# Altium project etherceptor.PrjPcb
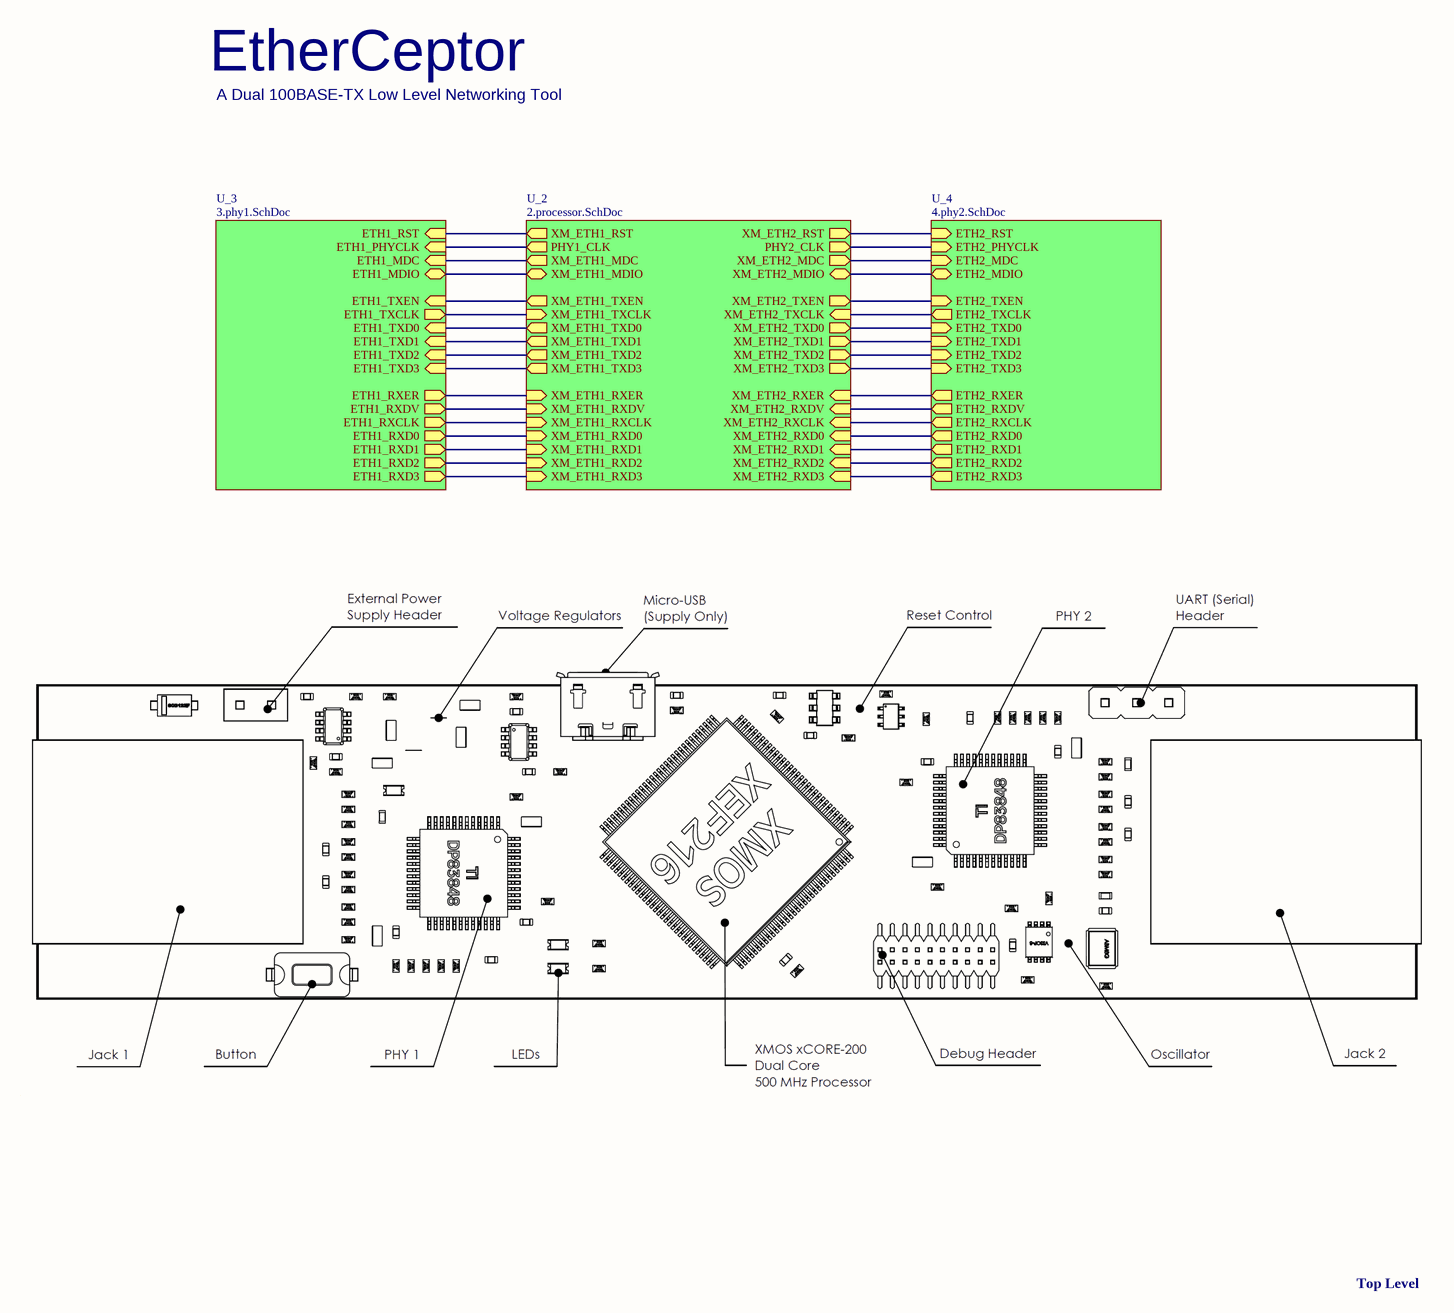
[diagram p0: 1.toplevel.SchDoc]
ProjectAuthor: Bianco Zandbergen; ProjectDisplayName: EtherCeptor; ProjectRevision: 1V0; Title: EtherCeptor
4 sheets, 133 parts. Net scope: hierarchical (ports join the sheet entries above them; power ports are global).
Board file: pcb.PcbDoc
Sheets:
  1.toplevel.SchDoc
    U_3 = 3.phy1.SchDoc
    U_4 = 4.phy2.SchDoc
    U_2 = 2.processor.SchDoc

## Sheet 1.toplevel.SchDoc: EtherCeptor
size A3; Organization: Altium Limited; Address1: L3, 12a Rodborough Rd; Address2: Frenchs Forest; Address3: NSW; Address4: Australia 2086; SheetNumber: 1; SheetTotal: 4

### Sub-sheets
U_2 = 2.processor.SchDoc: PHY1_CLK (out), PHY2_CLK (out), XM_ETH1_RST (out), XM_ETH1_TXCLK (in), XM_ETH1_TXD0 (out), XM_ETH1_TXD1 (out), XM_ETH1_TXD2 (out), XM_ETH1_TXD3 (out), XM_ETH1_TXEN (out), XM_ETH1_MDIO (bidir), XM_ETH1_MDC (out), XM_ETH1_RXER (in), XM_ETH1_RXDV (in), XM_ETH1_RXD0 (in), XM_ETH1_RXD1 (in), XM_ETH1_RXD2 (in), XM_ETH1_RXD3 (in), XM_ETH1_RXCLK (in), XM_ETH2_RST (out), XM_ETH2_TXCLK (in), XM_ETH2_TXD0 (out), XM_ETH2_TXD1 (out), XM_ETH2_TXD2 (out), XM_ETH2_TXD3 (out), XM_ETH2_TXEN (out), XM_ETH2_MDIO (bidir), XM_ETH2_MDC (out), XM_ETH2_RXER (in), XM_ETH2_RXDV (in), XM_ETH2_RXD0 (in), XM_ETH2_RXD1 (in), XM_ETH2_RXD2 (in), XM_ETH2_RXD3 (in), XM_ETH2_RXCLK (in)
U_3 = 3.phy1.SchDoc: ETH1_TXCLK (out), ETH1_RST (in), ETH1_TXD0 (in), ETH1_TXD1 (in), ETH1_TXD2 (in), ETH1_TXD3 (in), ETH1_TXEN (in), ETH1_MDC (in), ETH1_MDIO (bidir), ETH1_RXER (out), ETH1_RXDV (out), ETH1_RXD0 (out), ETH1_RXD1 (out), ETH1_RXD2 (out), ETH1_RXD3 (out), ETH1_RXCLK (out), ETH1_PHYCLK (in)
U_4 = 4.phy2.SchDoc: ETH2_TXCLK (out), ETH2_RST (in), ETH2_TXD0 (in), ETH2_TXD1 (in), ETH2_TXD2 (in), ETH2_TXD3 (in), ETH2_TXEN (in), ETH2_MDC (in), ETH2_MDIO (bidir), ETH2_RXER (out), ETH2_RXDV (out), ETH2_RXD0 (out), ETH2_RXD1 (out), ETH2_RXD2 (out), ETH2_RXD3 (out), ETH2_RXCLK (out), ETH2_PHYCLK (in)

### Nets
ETH1_MDC: sheet U_3/ETH1_MDC, sheet U_2/XM_ETH1_MDC
ETH1_MDIO: sheet U_3/ETH1_MDIO, sheet U_2/XM_ETH1_MDIO
ETH1_PHYCLK: sheet U_3/ETH1_PHYCLK, sheet U_2/PHY1_CLK
ETH1_RST: sheet U_3/ETH1_RST, sheet U_2/XM_ETH1_RST
ETH1_RXCLK: sheet U_3/ETH1_RXCLK, sheet U_2/XM_ETH1_RXCLK
ETH1_RXD0: sheet U_3/ETH1_RXD0, sheet U_2/XM_ETH1_RXD0
ETH1_RXD1: sheet U_3/ETH1_RXD1, sheet U_2/XM_ETH1_RXD1
ETH1_RXD2: sheet U_3/ETH1_RXD2, sheet U_2/XM_ETH1_RXD2
ETH1_RXD3: sheet U_3/ETH1_RXD3, sheet U_2/XM_ETH1_RXD3
ETH1_RXDV: sheet U_3/ETH1_RXDV, sheet U_2/XM_ETH1_RXDV
ETH1_RXER: sheet U_3/ETH1_RXER, sheet U_2/XM_ETH1_RXER
ETH1_TXCLK: sheet U_3/ETH1_TXCLK, sheet U_2/XM_ETH1_TXCLK
ETH1_TXD0: sheet U_3/ETH1_TXD0, sheet U_2/XM_ETH1_TXD0
ETH1_TXD1: sheet U_3/ETH1_TXD1, sheet U_2/XM_ETH1_TXD1
ETH1_TXD2: sheet U_3/ETH1_TXD2, sheet U_2/XM_ETH1_TXD2
ETH1_TXD3: sheet U_3/ETH1_TXD3, sheet U_2/XM_ETH1_TXD3
ETH1_TXEN: sheet U_3/ETH1_TXEN, sheet U_2/XM_ETH1_TXEN
ETH2_MDC: sheet U_4/ETH2_MDC, sheet U_2/XM_ETH2_MDC
ETH2_MDIO: sheet U_4/ETH2_MDIO, sheet U_2/XM_ETH2_MDIO
ETH2_PHYCLK: sheet U_4/ETH2_PHYCLK, sheet U_2/PHY2_CLK
ETH2_RST: sheet U_4/ETH2_RST, sheet U_2/XM_ETH2_RST
ETH2_RXCLK: sheet U_4/ETH2_RXCLK, sheet U_2/XM_ETH2_RXCLK
ETH2_RXD0: sheet U_4/ETH2_RXD0, sheet U_2/XM_ETH2_RXD0
ETH2_RXD1: sheet U_4/ETH2_RXD1, sheet U_2/XM_ETH2_RXD1
ETH2_RXD2: sheet U_4/ETH2_RXD2, sheet U_2/XM_ETH2_RXD2
ETH2_RXD3: sheet U_4/ETH2_RXD3, sheet U_2/XM_ETH2_RXD3
ETH2_RXDV: sheet U_4/ETH2_RXDV, sheet U_2/XM_ETH2_RXDV
ETH2_RXER: sheet U_4/ETH2_RXER, sheet U_2/XM_ETH2_RXER
ETH2_TXCLK: sheet U_4/ETH2_TXCLK, sheet U_2/XM_ETH2_TXCLK
ETH2_TXD0: sheet U_4/ETH2_TXD0, sheet U_2/XM_ETH2_TXD0
ETH2_TXD1: sheet U_4/ETH2_TXD1, sheet U_2/XM_ETH2_TXD1
ETH2_TXD2: sheet U_4/ETH2_TXD2, sheet U_2/XM_ETH2_TXD2
ETH2_TXD3: sheet U_4/ETH2_TXD3, sheet U_2/XM_ETH2_TXD3
ETH2_TXEN: sheet U_4/ETH2_TXEN, sheet U_2/XM_ETH2_TXEN

### Notes on the sheet
- EtherCeptor
- A Dual 100BASE-TX Low Level Networking Tool
- Top Level
- Title
- Size:
- Date:
- A3
- Number:
- Time:
- Revision:
- Sheet
- of
- File:

## Sheet 3.phy1.SchDoc: EtherCeptor
size A3; Organization: Altium Limited; Address1: L3, 12a Rodborough Rd; Address2: Frenchs Forest; Address3: NSW; Address4: Australia 2086; SheetNumber: 3; SheetTotal: 4
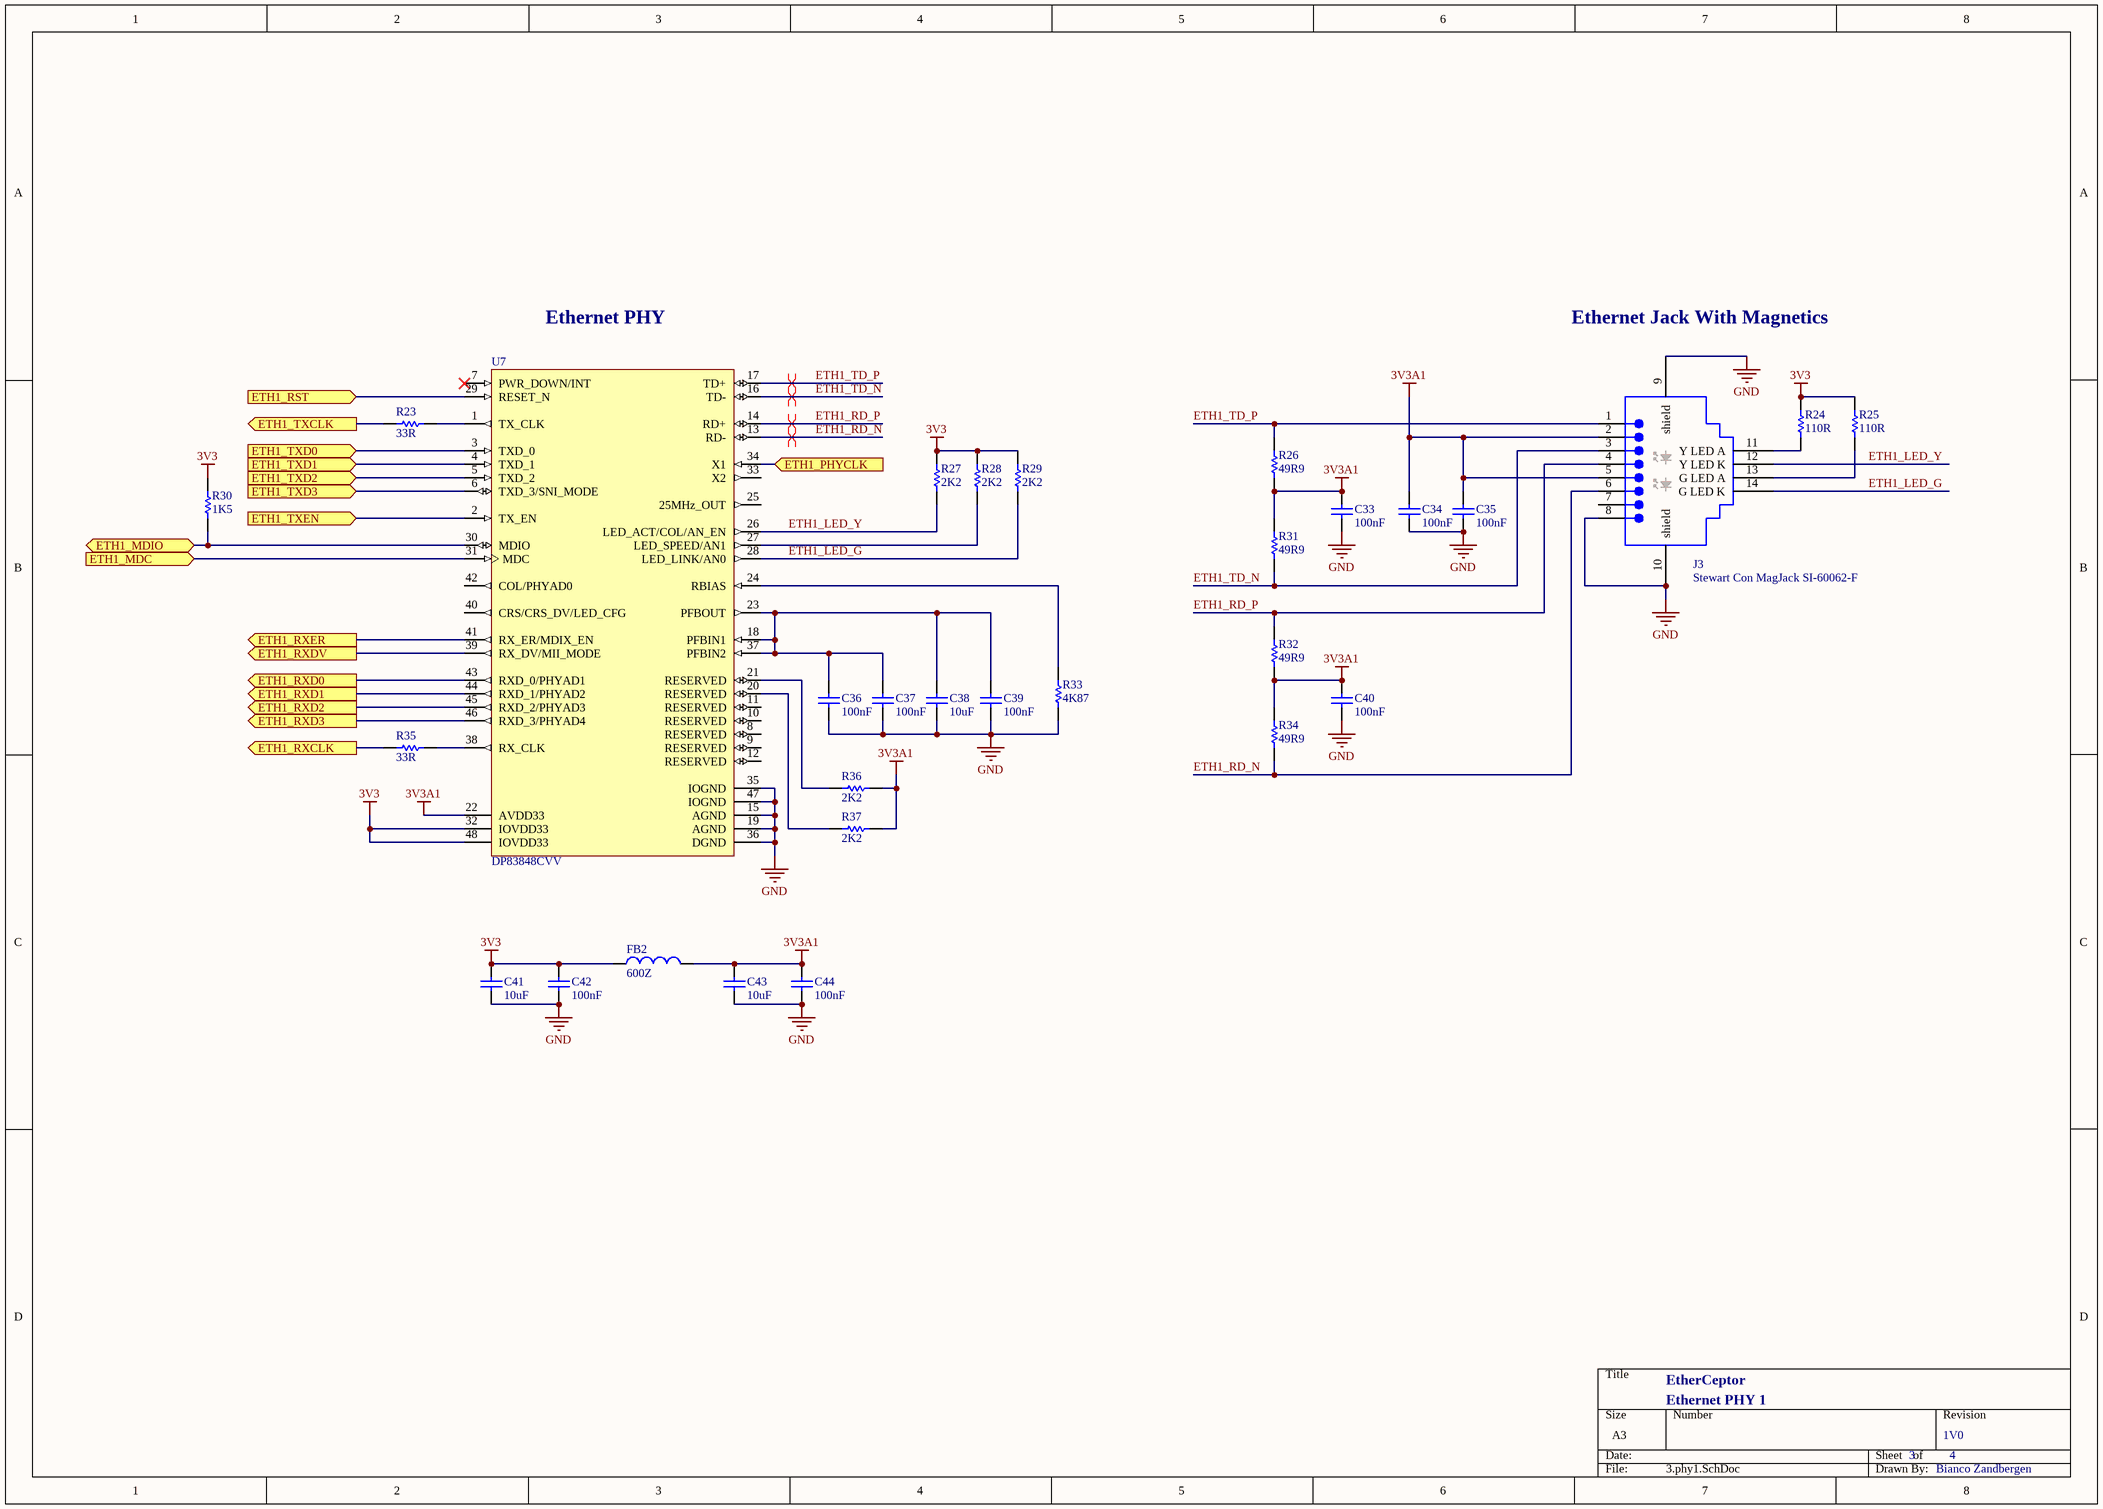
[diagram p1: 3.phy1.SchDoc]

### Parts
C33  value 100nF  [1005[0402]_CAP2]  (hidden comment: Cap)
C34  value 100nF  [1005[0402]_CAP2]  (hidden comment: Cap)
C35  value 100nF  [1005[0402]_CAP2]  (hidden comment: Cap)
C36  value 100nF  [1005[0402]_CAP2]  (hidden comment: Cap)
C37  value 100nF  [1005[0402]_CAP2]  (hidden comment: Cap)
C38  value 10uF  [1608[0603]_CAP2]  (hidden comment: Cap)
C39  value 100nF  [1005[0402]_CAP2]  (hidden comment: Cap)
C40  value 100nF  [1005[0402]_CAP2]  (hidden comment: Cap)
C41  value 10uF  [1608[0603]_CAP2]  (hidden comment: Cap)
C42  value 100nF  [1005[0402]_CAP2]  (hidden comment: Cap)
C43  value 10uF  [1608[0603]_CAP2]  (hidden comment: Cap)
C44  value 100nF  [1005[0402]_CAP2]  (hidden comment: Cap)
FB2  value 600Z  [1005[0402]_FB2]  (hidden comment: Ferrite Bead)
J3  Stewart Con MagJack SI-60062-F  [Steward Con RJ45]
R23  value 33R  [1005[0402]_RES2]  (hidden comment: Res)
R24  value 110R  [1005[0402]_RES2]  (hidden comment: Res)
R25  value 110R  [1005[0402]_RES2]  (hidden comment: Res)
R26  value 49R9  [1005[0402]_RES2]  (hidden comment: Res)
R27  value 2K2  [1005[0402]_RES2]  (hidden comment: Res)
R28  value 2K2  [1005[0402]_RES2]  (hidden comment: Res)
R29  value 2K2  [1005[0402]_RES2]  (hidden comment: Res)
R30  value 1K5  [1005[0402]_RES2]  (hidden comment: Res)
R31  value 49R9  [1005[0402]_RES2]  (hidden comment: Res)
R32  value 49R9  [1005[0402]_RES2]  (hidden comment: Res)
R33  value 4K87  [1005[0402]_RES2]  (hidden comment: Res)
R34  value 49R9  [1005[0402]_RES2]  (hidden comment: Res)
R35  value 33R  [1005[0402]_RES2]  (hidden comment: Res)
R36  value 2K2  [1005[0402]_RES2]  (hidden comment: Res)
R37  value 2K2  [1005[0402]_RES2]  (hidden comment: Res)
U7  DP83848CVV  [TSQFP50P900X900-48M]

### Ports
ETH1_MDC (in), ETH1_MDIO (bidir), ETH1_PHYCLK (in), ETH1_RST (in), ETH1_RXCLK (out), ETH1_RXD0 (out), ETH1_RXD1 (out), ETH1_RXD2 (out), ETH1_RXD3 (out), ETH1_RXDV (out), ETH1_RXER (out), ETH1_TXCLK (out), ETH1_TXD0 (in), ETH1_TXD1 (in), ETH1_TXD2 (in), ETH1_TXD3 (in), ETH1_TXEN (in)

### Nets
3V3: C41.2 C42.2 FB2.1 R24.2 R25.2 R27.2 R28.2 R29.2 R30.2 U7.32(IOVDD33) U7.48(IOVDD33)
3V3A1: C33.2 C34.2 C35.2 C40.2 C43.2 C44.2 FB2.2 J3.2 J3.5 R26.1 R31.2 R32.1 R34.2 R36.1 R37.1 U7.22(AVDD33)
GND: C33.1 C34.1 C35.1 C36.1 C37.1 C38.1 C39.1 C40.1 C41.1 C42.1 C43.1 C44.1 J3.8 J3.9(shield) J3.10(shield) R33.1 U7.15(AGND) U7.19(AGND) U7.35(IOGND) U7.36(DGND) U7.47(IOGND)
ETH1_LED_G: J3.14(G_LED_K) R29.1 U7.28(LED_LINK/AN0)
ETH1_LED_Y: J3.12(Y_LED_K) R27.1 U7.26(LED_ACT/COL/AN_EN)
ETH1_MDC: U7.31(MDC) ; port ETH1_MDC
ETH1_MDIO: R30.1 U7.30(MDIO) ; port ETH1_MDIO
ETH1_PHYCLK: U7.34(X1) ; port ETH1_PHYCLK
ETH1_RD_N: J3.6 R34.1 U7.13(RD-)
ETH1_RD_P: J3.4 R32.2 U7.14(RD+)
ETH1_RST: U7.29(RESET_N) ; port ETH1_RST
ETH1_RXCLK: R35.1 ; port ETH1_RXCLK
ETH1_RXD0: U7.43(RXD_0/PHYAD1) ; port ETH1_RXD0
ETH1_RXD1: U7.44(RXD_1/PHYAD2) ; port ETH1_RXD1
ETH1_RXD2: U7.45(RXD_2/PHYAD3) ; port ETH1_RXD2
ETH1_RXD3: U7.46(RXD_3/PHYAD4) ; port ETH1_RXD3
ETH1_RXDV: U7.39(RX_DV/MII_MODE) ; port ETH1_RXDV
ETH1_RXER: U7.41(RX_ER/MDIX_EN) ; port ETH1_RXER
ETH1_TD_N: J3.3 R31.1 U7.16(TD-)
ETH1_TD_P: J3.1 R26.2 U7.17(TD+)
ETH1_TXCLK: R23.1 ; port ETH1_TXCLK
ETH1_TXD0: U7.3(TXD_0) ; port ETH1_TXD0
ETH1_TXD1: U7.4(TXD_1) ; port ETH1_TXD1
ETH1_TXD2: U7.5(TXD_2) ; port ETH1_TXD2
ETH1_TXD3: U7.6(TXD_3/SNI_MODE) ; port ETH1_TXD3
ETH1_TXEN: U7.2(TX_EN) ; port ETH1_TXEN
NetC36_2: C36.2 C37.2 C38.2 C39.2 U7.18(PFBIN1) U7.23(PFBOUT) U7.37(PFBIN2)
NetJ3_11: J3.11(Y_LED_A) R24.1
NetJ3_13: J3.13(G_LED_A) R25.1
NetR23_2: R23.2 U7.1(TX_CLK)
NetR28_1: R28.1 U7.27(LED_SPEED/AN1)
NetR33_2: R33.2 U7.24(RBIAS)
NetR35_2: R35.2 U7.38(RX_CLK)
NetR36_2: R36.2 U7.21(RESERVED)
NetR37_2: R37.2 U7.20(RESERVED)

Not connected (* = marked no-connect by the designer): J3 7; U7 7(PWR_DOWN/INT)* 8(RESERVED) 9(RESERVED) 10(RESERVED) 11(RESERVED) 12(RESERVED) 25(25MHz_OUT) 33(X2) 40(CRS/CRS_DV/LED_CFG) 42(COL/PHYAD0)

### Layout directives
differential pair: ETH1_RD_N, ETH1_RD_P, ETH1_TD_N, ETH1_TD_P

### Notes on the sheet
- Ethernet PHY
- Ethernet Jack With Magnetics
- Ethernet PHY 1
- Title
- Size:
- Date:
- A3
- Number:
- Time:
- Revision:
- Sheet
- of
- File:

### Library data of the parts
C33-C37 C39 C40 C42 C44 = Cap: Capacitor; Manufacturer: SAMSUNG; ProductCode: CL05B104KO5NNNC; Vendor: Digikey; VendorCode: 1276-1001-1-ND; Published: 8-Jun-2000; LatestRevisionDate: 17-Jul-2002; LatestRevisionNote: Re-released for DXP Platform.; PackageReference: RAD-0.3; Publisher: Altium Limited; Price: 0,01
C38 C41 C43 = Cap: Capacitor; Manufacturer: SAMSUNG; VendorCode: 1276-6775-1-ND; Vendor: Digikey; ProductCode: CL10A106MPNNHBC; Published: 8-Jun-2000; LatestRevisionDate: 17-Jul-2002; LatestRevisionNote: Re-released for DXP Platform.; PackageReference: RAD-0.3; Publisher: Altium Limited; Price: 0,22
FB2 = Ferrite Bead: Manufacturer: MURATA; Code_IEC: 1005; ProductCode: BLM15AX601SN1D; Vendor: Digikey; VendorCode: 490-5441-1-ND; Published: 8-Jun-2000; LatestRevisionDate: 29-May-2009; LatestRevisionNote: IPC-7351 Footprint Added.; PackageReference: 0402-A; Publisher: Altium Limited; PackageDescription: Chip Inductor; Code_JEITA: 0402; Price: 0,11
J3 = Steward con RJ45 with magnetics: Right Angle,RJ45-Keyed, Flange Mount PCB Jack; Manufacturer: STEWART CONNECTOR; Ports: 1; Positions/Loaded: Port1 - 8 Keyed/8; PerformanceCategory: 3; PCB_Mounting: Thru-Hole; ComponentAvailability: Obsolete; DrillSize: Nominal, Rounded to nearest 0.05mm; PCB_Layout: Complies with Manufacturer's Recommendation.; Vendor: Digikey; VendorCode: 380-1106-ND; Published: 25-Jun-2002; DatasheetDocument: 18-Dec-2001; PackageDocument: 18-Dec-2001; PackageReference: 15-43-6233; Publisher: Altium Limited; ComponentLink1Description: Manufacturer Link; ComponentLink1URL: http://www.molex.com/; ComponentLink2Description: Datasheet; ComponentLink2URL: http://www.molex.com/cmc_upload/common_files/1212003_catalogmx41314.pdf; ComponentLink3Description: Iges Model; ComponentLink3URL: http://www.molex.com/pdm_docs/igs/15-43-6233_igs.zip; ProductCode: SI-60062-F; Price: 4,07
R23 R35 = Res: Resistor; Manufacturer: PANASONIC; Vendor: Digikey; VendorCode: P33JCT-ND; ProductCode: ERJ-2GEJ330X; Published: 8-Jun-2000; LatestRevisionDate: 17-Jul-2002; LatestRevisionNote: Re-released for DXP Platform.; PackageReference: AXIAL-0.3; Publisher: Altium Limited; Price: 0,02
R24 R25 = Res: Resistor; Manufacturer: PANASONIC; ProductCode: ERJ-2GEJ111X; VendorCode: P110JCT-ND; Vendor: Digikey; Published: 8-Jun-2000; LatestRevisionDate: 17-Jul-2002; LatestRevisionNote: Re-released for DXP Platform.; PackageReference: AXIAL-0.3; Publisher: Altium Limited; Price: 0,02
R26 R31 R32 R34 = Res: Resistor; Manufacturer: PANASONIC; ProductCode: ERJ-2RKF49R9X; VendorCode: P49.9LCT-ND; Vendor: Digikey; Published: 8-Jun-2000; LatestRevisionDate: 17-Jul-2002; LatestRevisionNote: Re-released for DXP Platform.; PackageReference: AXIAL-0.3; Publisher: Altium Limited; Price: 0,02
R27-R29 R36 R37 = Res: Resistor; Manufacturer: PANASONIC; Vendor: Digikey; VendorCode: P2.20KLCT-ND; ProductCode: ERJ-2RKF2201X; Published: 8-Jun-2000; LatestRevisionDate: 17-Jul-2002; LatestRevisionNote: Re-released for DXP Platform.; PackageReference: AXIAL-0.3; Publisher: Altium Limited; Price: 0,02
R30 = Res: Resistor; Manufacturer: PANASONIC; ProductCode: ERJ-2RKF1501X; VendorCode: P1.50KLCT-ND; Vendor: Digikey; Published: 8-Jun-2000; LatestRevisionDate: 17-Jul-2002; LatestRevisionNote: Re-released for DXP Platform.; PackageReference: AXIAL-0.3; Publisher: Altium Limited; Price: 0,09
R33 = Res: Resistor; Manufacturer: PANASONIC; ProductCode: ERJ-2RKF4871X; VendorCode: P4.87KLCT-ND; Vendor: Digikey; Published: 8-Jun-2000; LatestRevisionDate: 17-Jul-2002; LatestRevisionNote: Re-released for DXP Platform.; PackageReference: AXIAL-0.3; Publisher: Altium Limited; Price: 0,02
U7 = DP83848CVV: PHYTER® Commercial Temperature Single Port 10/100 Mb/s Ethernet Physical Layer Transceiver, 48-pin LQFP; Manufacturer: TEXAS INSTRUMENTS; PackageTopMarking: NSUZXYTT*DP83848VV*VBC; PowerWise: N; CompType: Interface IC; ProductCode: DP83848CVVX/NOPB; VendorCode: DP83848CVVX/NOPBCT-ND; Vendor: Digikey; Published: 4-Dec-2008; DatasheetVersion: May-2008; PackageVersion: revE, May-2007; PackageReference: VBH48A; Publisher: Altium Limited; PackageDescription: LQFP, 7 x 7 x 1.4mm, 48 Lead, 0.5mm Pitch; Supplier 1: Farnell; Supplier Part Number 1: 1286816; Supplier 2: Farnell; Supplier Part Number 2: 1528379; PartNumber: DP83848CVV; RoHS: Y; PinCount: 48; ComponentLink1Description: DP83848C Datasheet; ComponentLink1URL: http://www.national.com/ds/DP/DP83848C.pdf; ComponentLink2Description: DP83848C Web Page; ComponentLink2URL: http://www.national.com/pf/DP/DP83848C.html; ComponentLink3Description: VBH48A Package Page; ComponentLink3URL: http://www.national.com/packaging/folders/vbh48a.html; Price: 4,94

## Sheet 4.phy2.SchDoc: EtherCeptor
size A3; Organization: Altium Limited; Address1: L3, 12a Rodborough Rd; Address2: Frenchs Forest; Address3: NSW; Address4: Australia 2086; SheetNumber: 4; SheetTotal: 4
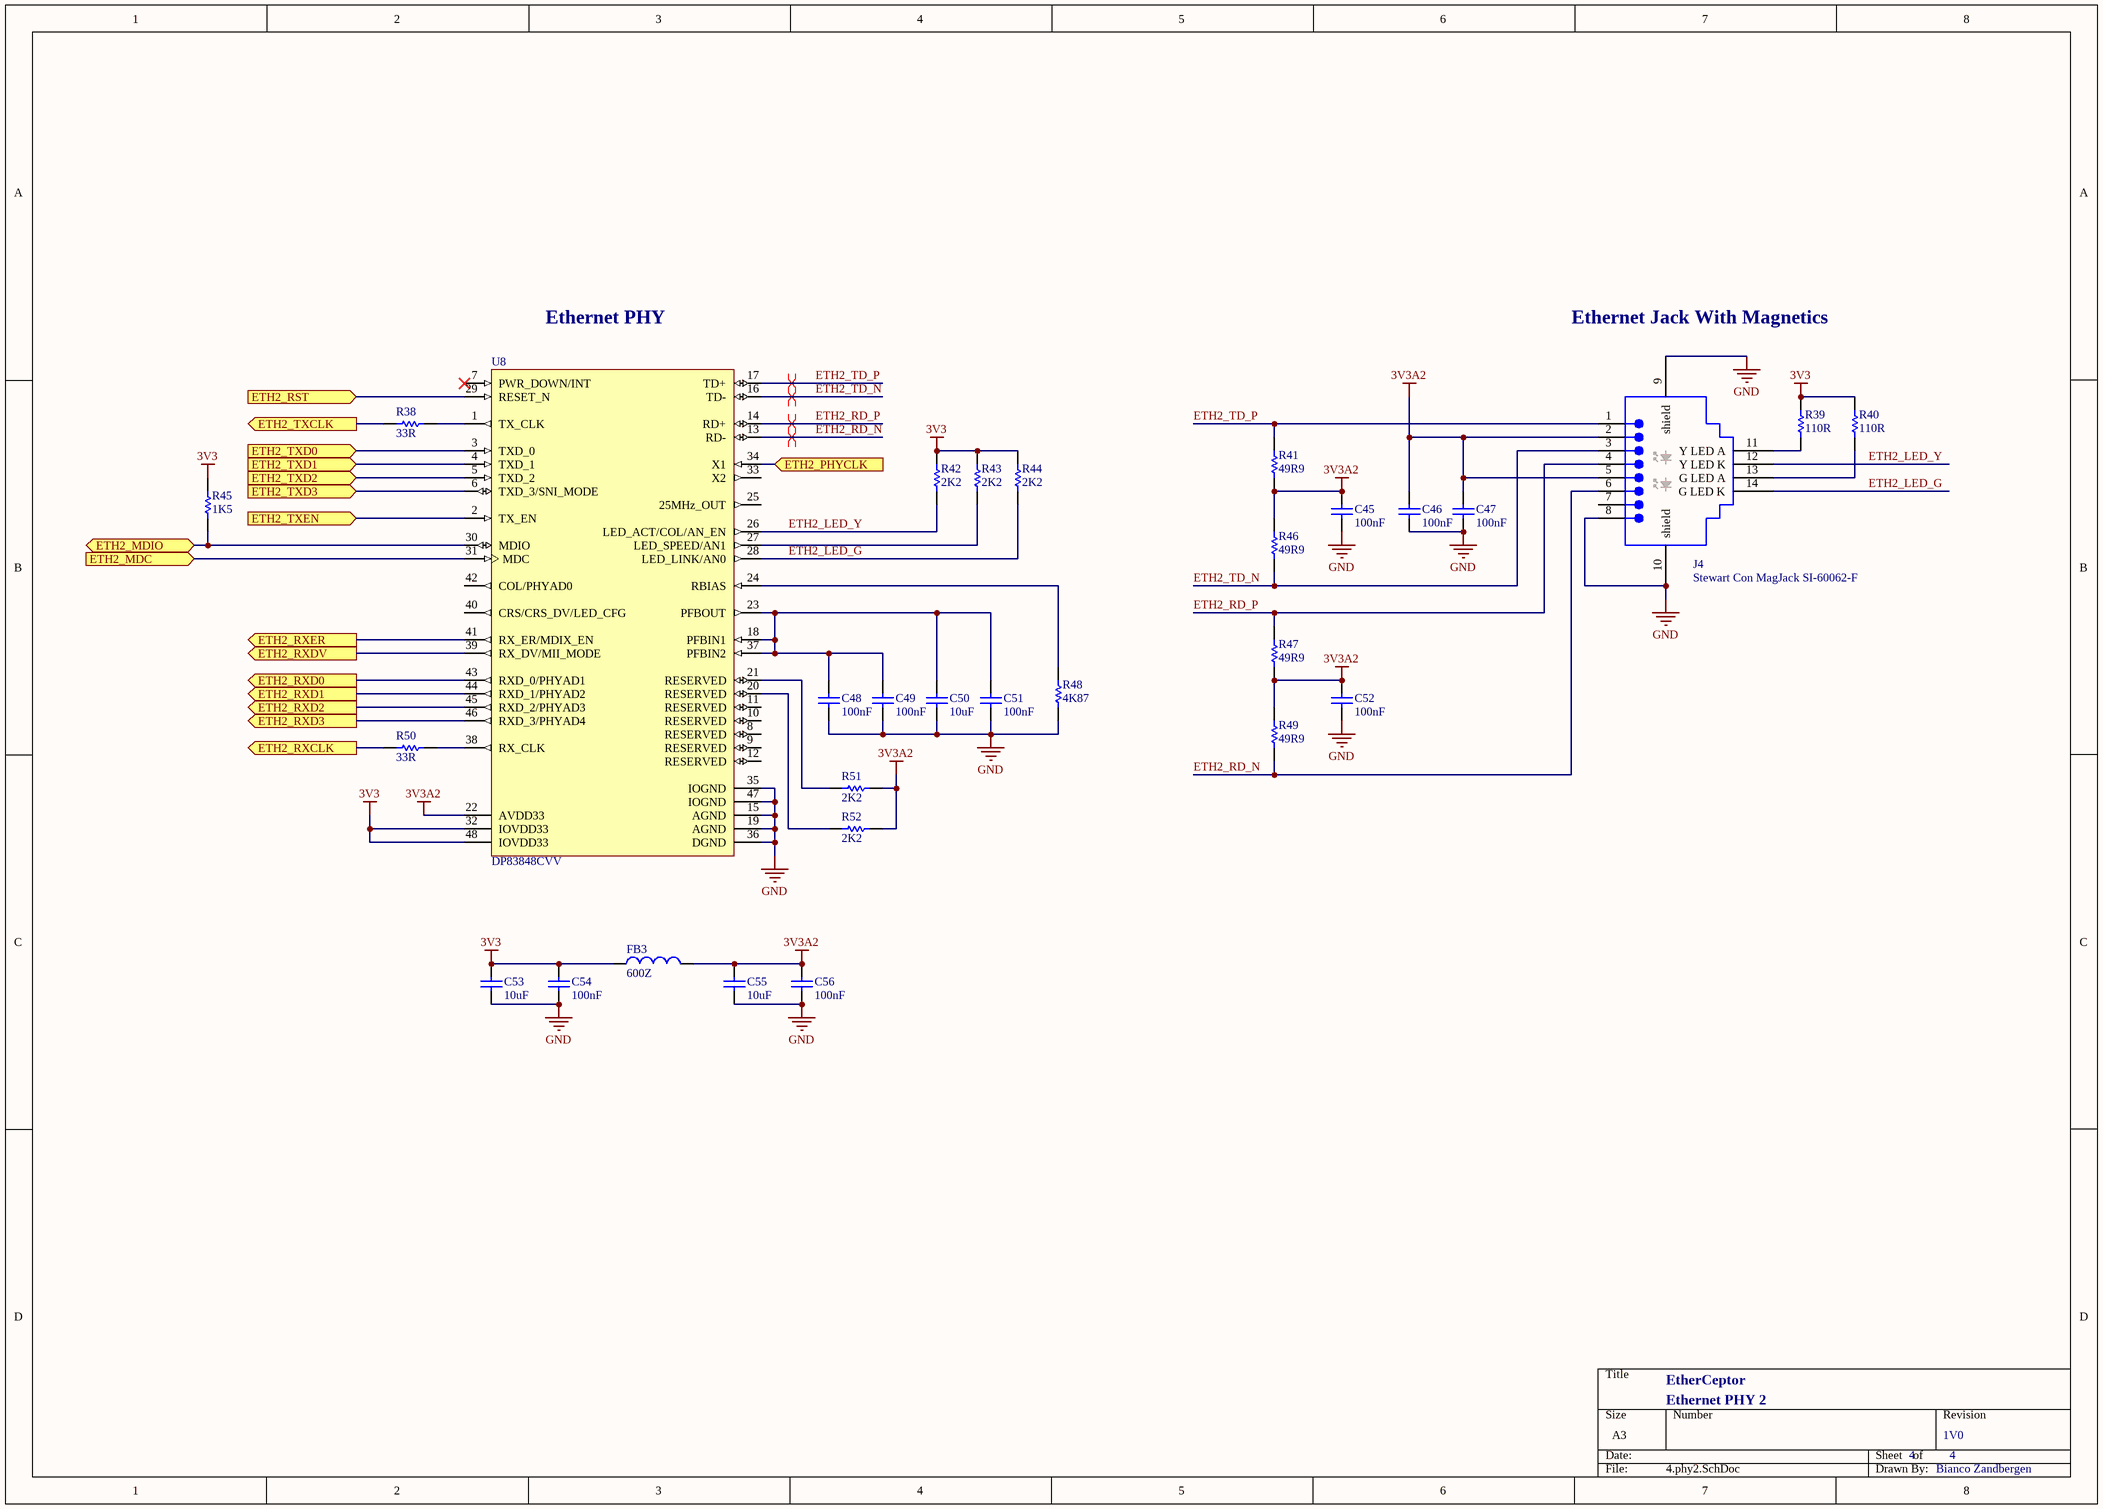
[diagram p2: 4.phy2.SchDoc]

### Parts
C45  value 100nF  [1005[0402]_CAP2]  (hidden comment: Cap)
C46  value 100nF  [1005[0402]_CAP2]  (hidden comment: Cap)
C47  value 100nF  [1005[0402]_CAP2]  (hidden comment: Cap)
C48  value 100nF  [1005[0402]_CAP2]  (hidden comment: Cap)
C49  value 100nF  [1005[0402]_CAP2]  (hidden comment: Cap)
C50  value 10uF  [1608[0603]_CAP2]  (hidden comment: Cap)
C51  value 100nF  [1005[0402]_CAP2]  (hidden comment: Cap)
C52  value 100nF  [1005[0402]_CAP2]  (hidden comment: Cap)
C53  value 10uF  [1608[0603]_CAP2]  (hidden comment: Cap)
C54  value 100nF  [1005[0402]_CAP2]  (hidden comment: Cap)
C55  value 10uF  [1608[0603]_CAP2]  (hidden comment: Cap)
C56  value 100nF  [1005[0402]_CAP2]  (hidden comment: Cap)
FB3  value 600Z  [1005[0402]_FB2]  (hidden comment: Ferrite Bead)
J4  Stewart Con MagJack SI-60062-F  [Steward Con RJ45]
R38  value 33R  [1005[0402]_RES2]  (hidden comment: Res)
R39  value 110R  [1005[0402]_RES2]  (hidden comment: Res)
R40  value 110R  [1005[0402]_RES2]  (hidden comment: Res)
R41  value 49R9  [1005[0402]_RES2]  (hidden comment: Res)
R42  value 2K2  [1005[0402]_RES2]  (hidden comment: Res)
R43  value 2K2  [1005[0402]_RES2]  (hidden comment: Res)
R44  value 2K2  [1005[0402]_RES2]  (hidden comment: Res)
R45  value 1K5  [1005[0402]_RES2]  (hidden comment: Res)
R46  value 49R9  [1005[0402]_RES2]  (hidden comment: Res)
R47  value 49R9  [1005[0402]_RES2]  (hidden comment: Res)
R48  value 4K87  [1005[0402]_RES2]  (hidden comment: Res)
R49  value 49R9  [1005[0402]_RES2]  (hidden comment: Res)
R50  value 33R  [1005[0402]_RES2]  (hidden comment: Res)
R51  value 2K2  [1005[0402]_RES2]  (hidden comment: Res)
R52  value 2K2  [1005[0402]_RES2]  (hidden comment: Res)
U8  DP83848CVV  [TSQFP50P900X900-48M]

### Ports
ETH2_MDC (in), ETH2_MDIO (bidir), ETH2_PHYCLK (in), ETH2_RST (in), ETH2_RXCLK (out), ETH2_RXD0 (out), ETH2_RXD1 (out), ETH2_RXD2 (out), ETH2_RXD3 (out), ETH2_RXDV (out), ETH2_RXER (out), ETH2_TXCLK (out), ETH2_TXD0 (in), ETH2_TXD1 (in), ETH2_TXD2 (in), ETH2_TXD3 (in), ETH2_TXEN (in)

### Nets
3V3: C53.2 C54.2 FB3.1 R39.2 R40.2 R42.2 R43.2 R44.2 R45.2 U8.32(IOVDD33) U8.48(IOVDD33)
3V3A2: C45.2 C46.2 C47.2 C52.2 C55.2 C56.2 FB3.2 J4.2 J4.5 R41.1 R46.2 R47.1 R49.2 R51.1 R52.1 U8.22(AVDD33)
GND: C45.1 C46.1 C47.1 C48.1 C49.1 C50.1 C51.1 C52.1 C53.1 C54.1 C55.1 C56.1 J4.8 J4.9(shield) J4.10(shield) R48.1 U8.15(AGND) U8.19(AGND) U8.35(IOGND) U8.36(DGND) U8.47(IOGND)
ETH2_LED_G: J4.14(G_LED_K) R44.1 U8.28(LED_LINK/AN0)
ETH2_LED_Y: J4.12(Y_LED_K) R42.1 U8.26(LED_ACT/COL/AN_EN)
ETH2_MDC: U8.31(MDC) ; port ETH2_MDC
ETH2_MDIO: R45.1 U8.30(MDIO) ; port ETH2_MDIO
ETH2_PHYCLK: U8.34(X1) ; port ETH2_PHYCLK
ETH2_RD_N: J4.6 R49.1 U8.13(RD-)
ETH2_RD_P: J4.4 R47.2 U8.14(RD+)
ETH2_RST: U8.29(RESET_N) ; port ETH2_RST
ETH2_RXCLK: R50.1 ; port ETH2_RXCLK
ETH2_RXD0: U8.43(RXD_0/PHYAD1) ; port ETH2_RXD0
ETH2_RXD1: U8.44(RXD_1/PHYAD2) ; port ETH2_RXD1
ETH2_RXD2: U8.45(RXD_2/PHYAD3) ; port ETH2_RXD2
ETH2_RXD3: U8.46(RXD_3/PHYAD4) ; port ETH2_RXD3
ETH2_RXDV: U8.39(RX_DV/MII_MODE) ; port ETH2_RXDV
ETH2_RXER: U8.41(RX_ER/MDIX_EN) ; port ETH2_RXER
ETH2_TD_N: J4.3 R46.1 U8.16(TD-)
ETH2_TD_P: J4.1 R41.2 U8.17(TD+)
ETH2_TXCLK: R38.1 ; port ETH2_TXCLK
ETH2_TXD0: U8.3(TXD_0) ; port ETH2_TXD0
ETH2_TXD1: U8.4(TXD_1) ; port ETH2_TXD1
ETH2_TXD2: U8.5(TXD_2) ; port ETH2_TXD2
ETH2_TXD3: U8.6(TXD_3/SNI_MODE) ; port ETH2_TXD3
ETH2_TXEN: U8.2(TX_EN) ; port ETH2_TXEN
NetC48_2: C48.2 C49.2 C50.2 C51.2 U8.18(PFBIN1) U8.23(PFBOUT) U8.37(PFBIN2)
NetJ4_11: J4.11(Y_LED_A) R39.1
NetJ4_13: J4.13(G_LED_A) R40.1
NetR38_2: R38.2 U8.1(TX_CLK)
NetR43_1: R43.1 U8.27(LED_SPEED/AN1)
NetR48_2: R48.2 U8.24(RBIAS)
NetR50_2: R50.2 U8.38(RX_CLK)
NetR51_2: R51.2 U8.21(RESERVED)
NetR52_2: R52.2 U8.20(RESERVED)

Not connected (* = marked no-connect by the designer): J4 7; U8 7(PWR_DOWN/INT)* 8(RESERVED) 9(RESERVED) 10(RESERVED) 11(RESERVED) 12(RESERVED) 25(25MHz_OUT) 33(X2) 40(CRS/CRS_DV/LED_CFG) 42(COL/PHYAD0)

### Layout directives
differential pair: ETH2_RD_N, ETH2_RD_P, ETH2_TD_N, ETH2_TD_P

### Notes on the sheet
- Ethernet PHY
- Ethernet Jack With Magnetics
- Ethernet PHY 2
- Title
- Size:
- Date:
- A3
- Number:
- Time:
- Revision:
- Sheet
- of
- File:

### Library data of the parts
C45-C49 C51 C52 C54 C56 = Cap: as C33 on sheet 3.phy1; Published: 8-Jun-2000; LatestRevisionDate: 17-Jul-2002; LatestRevisionNote: Re-released for DXP Platform.; PackageReference: RAD-0.3; Publisher: Altium Limited; Price: 0,01
C50 C53 C55 = Cap: as C38 on sheet 3.phy1; Published: 8-Jun-2000; LatestRevisionDate: 17-Jul-2002; LatestRevisionNote: Re-released for DXP Platform.; PackageReference: RAD-0.3; Publisher: Altium Limited; Price: 0,22
FB3 = Ferrite Bead: as FB2 on sheet 3.phy1; Published: 8-Jun-2000; LatestRevisionDate: 29-May-2009; LatestRevisionNote: IPC-7351 Footprint Added.; PackageReference: 0402-A; Publisher: Altium Limited; PackageDescription: Chip Inductor; Code_JEITA: 0402; Price: 0,11
J4 = Steward con RJ45 with magnetics: as J3 on sheet 3.phy1; Published: 25-Jun-2002; DatasheetDocument: 18-Dec-2001; PackageDocument: 18-Dec-2001; PackageReference: 15-43-6233; Publisher: Altium Limited; ComponentLink1Description: Manufacturer Link; ComponentLink1URL: http://www.molex.com/; ComponentLink2Description: Datasheet; ComponentLink2URL: http://www.molex.com/cmc_upload/common_files/1212003_catalogmx41314.pdf; ComponentLink3Description: Iges Model; ComponentLink3URL: http://www.molex.com/pdm_docs/igs/15-43-6233_igs.zip; ProductCode: SI-60062-F; Price: 4,07
R38 R50 = Res: as R23 on sheet 3.phy1; Published: 8-Jun-2000; LatestRevisionDate: 17-Jul-2002; LatestRevisionNote: Re-released for DXP Platform.; PackageReference: AXIAL-0.3; Publisher: Altium Limited; Price: 0,02
R39 R40 = Res: as R24 on sheet 3.phy1; Published: 8-Jun-2000; LatestRevisionDate: 17-Jul-2002; LatestRevisionNote: Re-released for DXP Platform.; PackageReference: AXIAL-0.3; Publisher: Altium Limited; Price: 0,02
R41 R46 R47 R49 = Res: as R26 on sheet 3.phy1; Published: 8-Jun-2000; LatestRevisionDate: 17-Jul-2002; LatestRevisionNote: Re-released for DXP Platform.; PackageReference: AXIAL-0.3; Publisher: Altium Limited; Price: 0,02
R42-R44 R51 R52 = Res: as R27 on sheet 3.phy1; Published: 8-Jun-2000; LatestRevisionDate: 17-Jul-2002; LatestRevisionNote: Re-released for DXP Platform.; PackageReference: AXIAL-0.3; Publisher: Altium Limited; Price: 0,02
R45 = Res: as R30 on sheet 3.phy1; Published: 8-Jun-2000; LatestRevisionDate: 17-Jul-2002; LatestRevisionNote: Re-released for DXP Platform.; PackageReference: AXIAL-0.3; Publisher: Altium Limited; Price: 0,09
R48 = Res: as R33 on sheet 3.phy1; Published: 8-Jun-2000; LatestRevisionDate: 17-Jul-2002; LatestRevisionNote: Re-released for DXP Platform.; PackageReference: AXIAL-0.3; Publisher: Altium Limited; Price: 0,02
U8 = DP83848CVV: as U7 on sheet 3.phy1; Published: 4-Dec-2008; DatasheetVersion: May-2008; PackageVersion: revE, May-2007; PackageReference: VBH48A; Publisher: Altium Limited; PackageDescription: LQFP, 7 x 7 x 1.4mm, 48 Lead, 0.5mm Pitch; Supplier 1: Farnell; Supplier Part Number 1: 1286816; Supplier 2: Farnell; Supplier Part Number 2: 1528379; PartNumber: DP83848CVV; RoHS: Y; PinCount: 48; ComponentLink1Description: DP83848C Datasheet; ComponentLink1URL: http://www.national.com/ds/DP/DP83848C.pdf; ComponentLink2Description: DP83848C Web Page; ComponentLink2URL: http://www.national.com/pf/DP/DP83848C.html; ComponentLink3Description: VBH48A Package Page; ComponentLink3URL: http://www.national.com/packaging/folders/vbh48a.html; Price: 4,94

## Sheet 2.processor.SchDoc: EtherCeptor
size A3; Organization: Altium Limited; Address1: L3, 12a Rodborough Rd; Address2: Frenchs Forest; Address3: NSW; Address4: Australia 2086; SheetNumber: 2; SheetTotal: 4
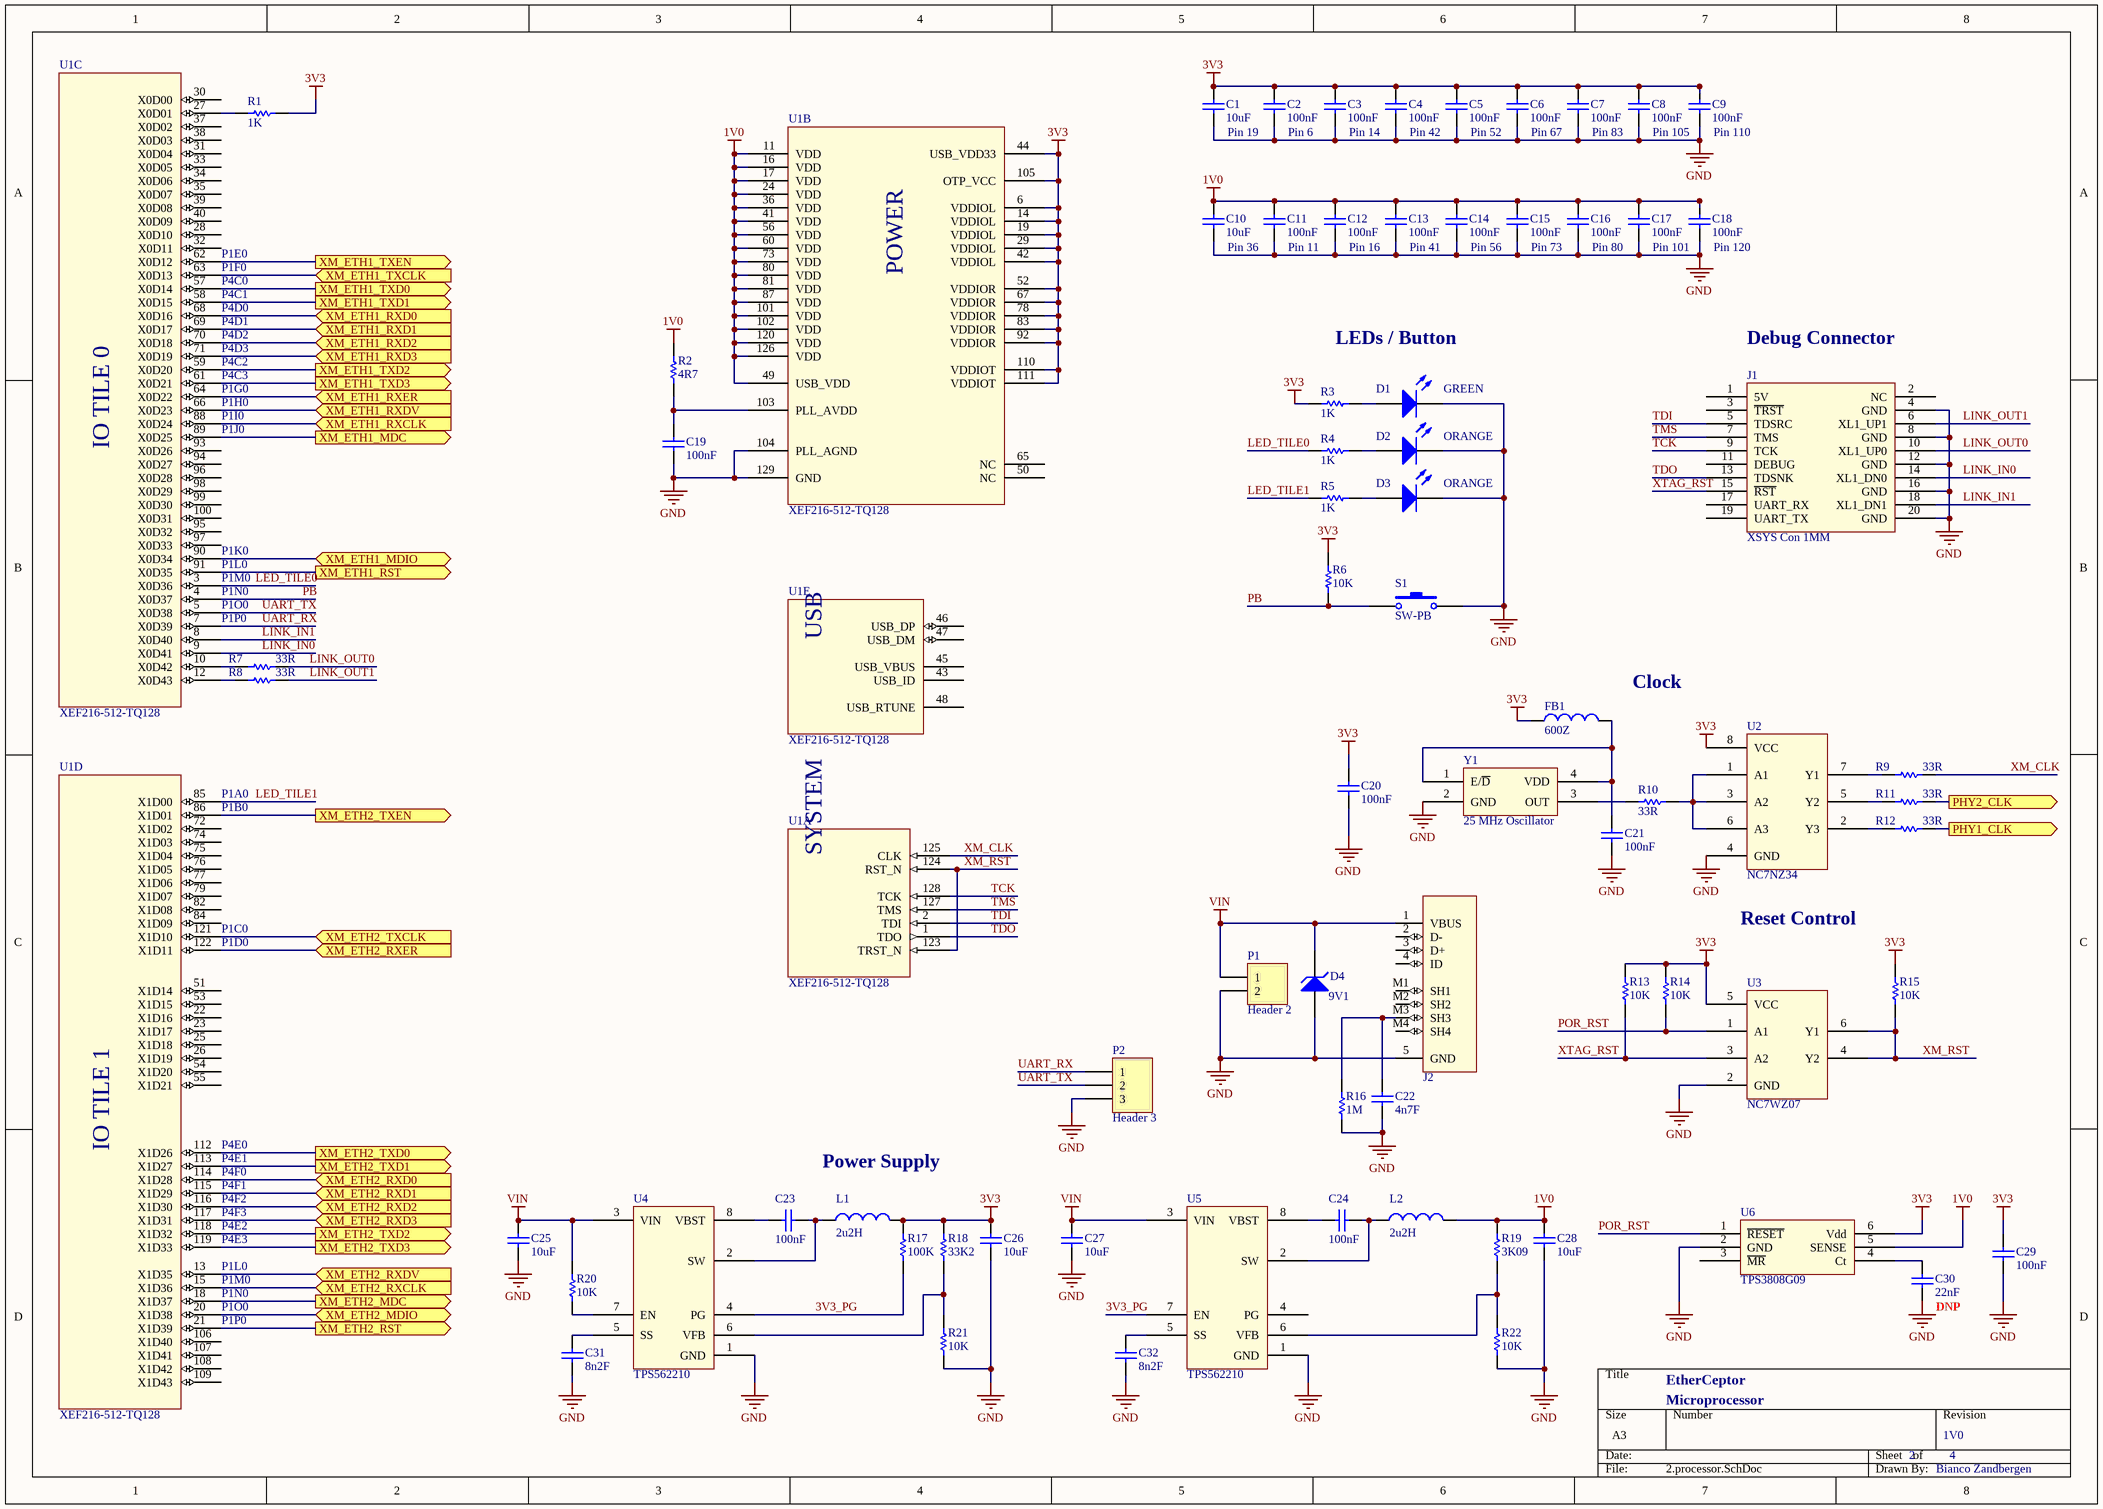
[diagram p3: 2.processor.SchDoc]

### Parts
C1  Pin 19  value 10uF  [1608[0603]_CAP2]
C2  Pin 6  value 100nF  [1005[0402]_CAP2]
C3  Pin 14  value 100nF  [1005[0402]_CAP2]
C4  Pin 42  value 100nF  [1005[0402]_CAP2]
C5  Pin 52  value 100nF  [1005[0402]_CAP2]
C6  Pin 67  value 100nF  [1005[0402]_CAP2]
C7  Pin 83  value 100nF  [1005[0402]_CAP2]
C8  Pin 105  value 100nF  [1005[0402]_CAP2]
C9  Pin 110  value 100nF  [1005[0402]_CAP2]
C10  Pin 36  value 10uF  [1608[0603]_CAP2]
C11  Pin 11  value 100nF  [1005[0402]_CAP2]
C12  Pin 16  value 100nF  [1005[0402]_CAP2]
C13  Pin 41  value 100nF  [1005[0402]_CAP2]
C14  Pin 56  value 100nF  [1005[0402]_CAP2]
C15  Pin 73  value 100nF  [1005[0402]_CAP2]
C16  Pin 80  value 100nF  [1005[0402]_CAP2]
C17  Pin 101  value 100nF  [1005[0402]_CAP2]
C18  Pin 120  value 100nF  [1005[0402]_CAP2]
C19  value 100nF  [1005[0402]_CAP2]  (hidden comment: Cap)
C20  value 100nF  [1005[0402]_CAP2]  (hidden comment: Cap)
C21  value 100nF  [1005[0402]_CAP2]  (hidden comment: Cap)
C22  value 4n7F  [1005[0402]_CAP2]  (hidden comment: Cap)
C23  value 100nF  [1005[0402]_CAP2]  (hidden comment: Cap)
C24  value 100nF  [1005[0402]_CAP2]  (hidden comment: Cap)
C25  value 10uF  [1608[0603]_CAP2]  (hidden comment: Cap)
C26  value 10uF  [1608[0603]_CAP2]  (hidden comment: Cap)
C27  value 10uF  [1608[0603]_CAP2]  (hidden comment: Cap)
C28  value 10uF  [1608[0603]_CAP2]  (hidden comment: Cap)
C29  value 100nF  [1005[0402]_CAP2]  (hidden comment: Cap)
C30  value 22nF  [1005[0402]_CAP2]  (hidden comment: Cap)
C31  value 8n2F  [1005[0402]_CAP2]  (hidden comment: Cap)
C32  value 8n2F  [1005[0402]_CAP2]  (hidden comment: Cap)
D1  value GREEN  [1608[0603]_LED]  (hidden comment: LED3)
D2  value ORANGE  [1608[0603]_LED]  (hidden comment: LED3)
D3  value ORANGE  [1608[0603]_LED]  (hidden comment: LED3)
D4  value 9V1  [SOD123F]  (hidden comment: Zener Diode)
FB1  value 600Z  [1005[0402]_FB2]  (hidden comment: Ferrite Bead)
J1  XSYS Con 1MM  [M40-3201045R]
J2  Micro-USB B Receptacle  [MOLEX_105017-0001]  (value not drawn)
L1  value 2u2H  [2012[0805]_IND]  (hidden comment: Inductor)
L2  value 2u2H  [2012[0805]_IND]  (hidden comment: Inductor)
P1  Header 2  [HDR1X2]
P2  Header 3  [HDR1X3]
R1  value 1K  [1005[0402]_RES2]  (hidden comment: Res)
R2  value 4R7  [1005[0402]_RES2]  (hidden comment: Res)
R3  value 1K  [1005[0402]_RES2]  (hidden comment: Res)
R4  value 1K  [1005[0402]_RES2]  (hidden comment: Res)
R5  value 1K  [1005[0402]_RES2]  (hidden comment: Res)
R6  value 10K  [1005[0402]_RES2]  (hidden comment: Res)
R7  value 33R  [1005[0402]_RES2]  (hidden comment: Res)
R8  value 33R  [1005[0402]_RES2]  (hidden comment: Res)
R9  value 33R  [1005[0402]_RES2]  (hidden comment: Res)
R10  value 33R  [1005[0402]_RES2]  (hidden comment: Res)
R11  value 33R  [1005[0402]_RES2]  (hidden comment: Res)
R12  value 33R  [1005[0402]_RES2]  (hidden comment: Res)
R13  value 10K  [1005[0402]_RES2]  (hidden comment: Res)
R14  value 10K  [1005[0402]_RES2]  (hidden comment: Res)
R15  value 10K  [1005[0402]_RES2]  (hidden comment: Res)
R16  value 1M  [1005[0402]_RES2]  (hidden comment: Res)
R17  value 100K  [1005[0402]_RES2]  (hidden comment: Res)
R18  value 33K2  [1005[0402]_RES2]  (hidden comment: Res)
R19  value 3K09  [1005[0402]_RES2]  (hidden comment: Res)
R20  value 10K  [1005[0402]_RES2]  (hidden comment: Res)
R21  value 10K  [1005[0402]_RES2]  (hidden comment: Res)
R22  value 10K  [1005[0402]_RES2]  (hidden comment: Res)
S1  SW-PB  [TACTILE_SW_6035_1]
U1  XEF216-512-TQ128  [XMOS_LQFP_128_XEF216_512]  (parts A,B,C,D,E of 5)
U2  NC7NZ34  [US8]
U3  NC7WZ07  [SOT363-6M_SC70]
U4  TPS562210  [SOT-23-8]
U5  TPS562210  [SOT-23-8]
U6  TPS3808G09  [SOT23-6]
Y1  25 MHz Oscillator  [OSC_32_25]

### Ports
PHY1_CLK (out), PHY2_CLK (out), XM_ETH1_MDC (out), XM_ETH1_MDIO (bidir), XM_ETH1_RST (out), XM_ETH1_RXCLK (in), XM_ETH1_RXD0 (in), XM_ETH1_RXD1 (in), XM_ETH1_RXD2 (in), XM_ETH1_RXD3 (in), XM_ETH1_RXDV (in), XM_ETH1_RXER (in), XM_ETH1_TXCLK (in), XM_ETH1_TXD0 (out), XM_ETH1_TXD1 (out), XM_ETH1_TXD2 (out), XM_ETH1_TXD3 (out), XM_ETH1_TXEN (out), XM_ETH2_MDC (out), XM_ETH2_MDIO (bidir), XM_ETH2_RST (out), XM_ETH2_RXCLK (in), XM_ETH2_RXD0 (in), XM_ETH2_RXD1 (in), XM_ETH2_RXD2 (in), XM_ETH2_RXD3 (in), XM_ETH2_RXDV (in), XM_ETH2_RXER (in), XM_ETH2_TXCLK (in), XM_ETH2_TXD0 (out), XM_ETH2_TXD1 (out), XM_ETH2_TXD2 (out), XM_ETH2_TXD3 (out), XM_ETH2_TXEN (out)

### Nets
1V0: C10.2 C11.2 C12.2 C13.2 C14.2 C15.2 C16.2 C17.2 C18.2 C28.2 L2.2 R2.2 R19.2 U1.11(VDD) U1.16(VDD) U1.17(VDD) U1.24(VDD) U1.36(VDD) U1.41(VDD) U1.49(USB_VDD) U1.56(VDD) U1.60(VDD) U1.73(VDD) U1.80(VDD) U1.81(VDD) U1.87(VDD) U1.101(VDD) U1.102(VDD) U1.120(VDD) U1.126(VDD) U6.5(SENSE)
3V3: C1.2 C2.2 C3.2 C4.2 C5.2 C6.2 C7.2 C8.2 C9.2 C20.2 C26.2 C29.2 FB1.1 L1.2 R1.2 R3.2 R6.2 R13.2 R14.2 R15.2 R17.2 R18.2 U1.6(VDDIOL) U1.14(VDDIOL) U1.19(VDDIOL) U1.29(VDDIOL) U1.42(VDDIOL) U1.44(USB_VDD33) U1.52(VDDIOR) U1.67(VDDIOR) U1.78(VDDIOR) U1.83(VDDIOR) U1.92(VDDIOR) U1.105(OTP_VCC) U1.110(VDDIOT) U1.111(VDDIOT) U2.8(VCC) U3.5(VCC) U6.6(Vdd)
GND: C1.1 C2.1 C3.1 C4.1 C5.1 C6.1 C7.1 C8.1 C9.1 C10.1 C11.1 C12.1 C13.1 C14.1 C15.1 C16.1 C17.1 C18.1 C19.1 C20.1 C21.1 C22.1 C25.1 C26.1 C27.1 C28.1 C29.1 C30.1 C31.1 C32.1 D1.2(K) D2.2(K) D3.2(K) D4.1(A) J1.4(GND) J1.8(GND) J1.12(GND) J1.16(GND) J1.20(GND) J2.5(GND) P1.2 P2.3 R16.1 R21.1 R22.1 S1.2 U1.104(PLL_AGND) U1.129(GND) U2.4(GND) U3.2(GND) U4.1(GND) U5.1(GND) U6.2(GND) Y1.2(GND)
VIN: C25.2 C27.2 D4.2(K) J2.1(VBUS) P1.1 R20.2 U4.3(VIN) U5.3(VIN)
3V3_PG: R17.1 U4.4(PG) U5.7(EN)
ETH1_MDC: U1.89(X0D25) ; port XM_ETH1_MDC
ETH1_MDIO: U1.90(X0D34) ; port XM_ETH1_MDIO
ETH1_PHYCLK: R12.1 ; port PHY1_CLK
ETH1_RST: U1.91(X0D35) ; port XM_ETH1_RST
ETH1_RXCLK: U1.88(X0D24) ; port XM_ETH1_RXCLK
ETH1_RXD0: U1.68(X0D16) ; port XM_ETH1_RXD0
ETH1_RXD1: U1.69(X0D17) ; port XM_ETH1_RXD1
ETH1_RXD2: U1.70(X0D18) ; port XM_ETH1_RXD2
ETH1_RXD3: U1.71(X0D19) ; port XM_ETH1_RXD3
ETH1_RXDV: U1.66(X0D23) ; port XM_ETH1_RXDV
ETH1_RXER: U1.64(X0D22) ; port XM_ETH1_RXER
ETH1_TXCLK: U1.63(X0D13) ; port XM_ETH1_TXCLK
ETH1_TXD0: U1.57(X0D14) ; port XM_ETH1_TXD0
ETH1_TXD1: U1.58(X0D15) ; port XM_ETH1_TXD1
ETH1_TXD2: U1.59(X0D20) ; port XM_ETH1_TXD2
ETH1_TXD3: U1.61(X0D21) ; port XM_ETH1_TXD3
ETH1_TXEN: U1.62(X0D12) ; port XM_ETH1_TXEN
ETH2_MDC: U1.18(X1D37) ; port XM_ETH2_MDC
ETH2_MDIO: U1.20(X1D38) ; port XM_ETH2_MDIO
ETH2_PHYCLK: R11.1 ; port PHY2_CLK
ETH2_RST: U1.21(X1D39) ; port XM_ETH2_RST
ETH2_RXCLK: U1.15(X1D36) ; port XM_ETH2_RXCLK
ETH2_RXD0: U1.114(X1D28) ; port XM_ETH2_RXD0
ETH2_RXD1: U1.115(X1D29) ; port XM_ETH2_RXD1
ETH2_RXD2: U1.116(X1D30) ; port XM_ETH2_RXD2
ETH2_RXD3: U1.117(X1D31) ; port XM_ETH2_RXD3
ETH2_RXDV: U1.13(X1D35) ; port XM_ETH2_RXDV
ETH2_RXER: U1.122(X1D11) ; port XM_ETH2_RXER
ETH2_TXCLK: U1.121(X1D10) ; port XM_ETH2_TXCLK
ETH2_TXD0: U1.112(X1D26) ; port XM_ETH2_TXD0
ETH2_TXD1: U1.113(X1D27) ; port XM_ETH2_TXD1
ETH2_TXD2: U1.118(X1D32) ; port XM_ETH2_TXD2
ETH2_TXD3: U1.119(X1D33) ; port XM_ETH2_TXD3
ETH2_TXEN: U1.86(X1D01) ; port XM_ETH2_TXEN
LED_TILE0: R4.2 U1.3(X0D36)
LED_TILE1: R5.2 U1.85(X1D00)
LINK_IN0: J1.14(XL1_DN0) U1.9(X0D41)
LINK_IN1: J1.18(XL1_DN1) U1.8(X0D40)
LINK_OUT0: J1.10(XL1_UP0) R7.1
LINK_OUT1: J1.6(XL1_UP1) R8.1
PB: R6.1 S1.1 U1.4(X0D37)
POR_RST: R14.1 U3.1(A1) U6.1(~{RESET})
TCK: J1.9(TCK) U1.128(TCK)
TDI: J1.5(TDSRC) U1.2(TDI)
TDO: J1.13(TDSNK) U1.1(TDO)
TMS: J1.7(TMS) U1.127(TMS)
UART_RX: P2.1 U1.7(X0D39)
UART_TX: P2.2 U1.5(X0D38)
XM_CLK: R9.1 U1.125(CLK)
XM_RST: R15.1 U1.123(TRST_N) U1.124(RST_N) U3.4(Y2) U3.6(Y1)
XTAG_RST: J1.15(~{RST}) R13.1 U3.3(A2)
NetC19_2: C19.2 R2.1 U1.103(PLL_AVDD)
NetC21_2: C21.2 FB1.2 Y1.1(E/~{D}) Y1.4(VDD)
NetC22_2: C22.2 J2.M3(SH3) R16.2
NetC23_1: C23.1 U4.8(VBST)
NetC23_2: C23.2 L1.1 U4.2(SW)
NetC24_1: C24.1 U5.8(VBST)
NetC24_2: C24.2 L2.1 U5.2(SW)
NetC30_2: C30.2 U6.4(Ct)
NetC31_2: C31.2 U4.5(SS)
NetC32_2: C32.2 U5.5(SS)
NetD1_1: D1.1(A) R3.1
NetD2_1: D2.1(A) R4.1
NetD3_1: D3.1(A) R5.1
NetR1_1: R1.1 U1.27(X0D01)
NetR7_2: R7.2 U1.10(X0D42)
NetR8_2: R8.2 U1.12(X0D43)
NetR9_2: R9.2 U2.7(Y1)
NetR10_1: R10.1 U2.1(A1) U2.3(A2) U2.6(A3)
NetR10_2: R10.2 Y1.3(OUT)
NetR11_2: R11.2 U2.5(Y2)
NetR12_2: R12.2 U2.2(Y3)
NetR18_1: R18.1 R21.2 U4.6(VFB)
NetR19_1: R19.1 R22.2 U5.6(VFB)
NetR20_1: R20.1 U4.7(EN)

Not connected (* = marked no-connect by the designer): J1 1(5V) 2(NC) 3(~{TRST}) 11(DEBUG) 17(UART_RX) 19(UART_TX); J2 2(D-) 3(D+) 4(ID) M1(SH1) M2(SH2) M4(SH4); U1 22(X1D16) 23(X1D17) 25(X1D18) 26(X1D19) 28(X0D10) 30(X0D00) 31(X0D04) 32(X0D11) 33(X0D05) 34(X0D06) 35(X0D07) 37(X0D02) 38(X0D03) 39(X0D08) 40(X0D09) 43(USB_ID) 45(USB_VBUS) 46(USB_DP) 47(USB_DM) 48(USB_RTUNE) 50(NC) 51(X1D14) 53(X1D15) 54(X1D20) 55(X1D21) 65(NC) 72(X1D02) 74(X1D03) 75(X1D04) 76(X1D05) 77(X1D06) 79(X1D07) 82(X1D08) 84(X1D09) 93(X0D26) 94(X0D27) 95(X0D32) 96(X0D28) 97(X0D33) 98(X0D29) 99(X0D30) 100(X0D31) 106(X1D40) 107(X1D41) 108(X1D42) 109(X1D43); U5 4(PG); U6 3(~{MR})

### Notes on the sheet
- (near U1) P1E0
- (near U1) P1F0
- (near U1) P4C0
- (near U1) P4C1
- (near U1) P4D0
- (near U1) P4D1
- (near U1) P4D2
- (near U1) P4D3
- (near U1) P4C2
- (near U1) P4C3
- LEDs / Button
- (near J1) Debug Connector
- (near U1) P1G0
- (near U1) P1H0
- (near U1) P1I0
- (near U1) P1J0
- (near U1) P1K0
- (near U1) P1L0
- (near U1) P1M0
- (near U1) P1N0
- P1O0
- P1P0
- (near FB1) Clock
- (near U1) P1A0
- (near U1) P1B0
- (near U1) P1C0
- (near U1) P1D0
- Reset Control
- (near U1) P4E0
- (near U1) P4E1
- (near U1) P4F0
- (near U1) P4F1
- Power Supply
- (near U1) P4F2
- (near U1) P4F3
- (near U1) P4E2
- (near U1) P4E3
- (near U1) P1O0
- (near U1) P1P0
- (near C30) DNP
- Microprocessor
- Title
- Size:
- Date:
- A3
- Number:
- Time:
- Revision:
- Sheet
- of
- File:
- (in symbol XEF216-512-TQ128, part A) SYSTEM
- (in symbol XEF216-512-TQ128, part B) POWER
- (in symbol XEF216-512-TQ128, part C) IO TILE 0
- (in symbol XEF216-512-TQ128, part D) IO TILE 1
- (in symbol XEF216-512-TQ128, part E) USB

### Library data of the parts
C1 C10 C25-C28 = Cap: Capacitor; Manufacturer: SAMSUNG; Vendor: Digikey; VendorCode: 1276-6775-1-ND; ProductCode: CL10A106MPNNHBC; Published: 8-Jun-2000; LatestRevisionDate: 17-Jul-2002; LatestRevisionNote: Re-released for DXP Platform.; PackageReference: RAD-0.3; Publisher: Altium Limited; Price: 0,22
C2-C9 C11-C21 C23 C24 C29 = Cap: as C33 on sheet 3.phy1; Published: 8-Jun-2000; LatestRevisionDate: 17-Jul-2002; LatestRevisionNote: Re-released for DXP Platform.; PackageReference: RAD-0.3; Publisher: Altium Limited; Price: 0,01
C22 = Cap: Capacitor; Manufacturer: SAMSUNG; Vendor: Digikey; ProductCode: CL05B472KB5NNNC; VendorCode: 1276-1125-1-ND; Published: 8-Jun-2000; LatestRevisionDate: 17-Jul-2002; LatestRevisionNote: Re-released for DXP Platform.; PackageReference: RAD-0.3; Publisher: Altium Limited; Price: 0,09
C30 = Cap: Capacitor; Manufacturer: SAMSUNG; ProductCode: CL05B223KP5NNNC; Vendor: Digikey; VendorCode: 1276-1538-1-ND; Published: 8-Jun-2000; LatestRevisionDate: 17-Jul-2002; LatestRevisionNote: Re-released for DXP Platform.; PackageReference: RAD-0.3; Publisher: Altium Limited; Price: 0,10
C31 C32 = Cap: Capacitor; Manufacturer: SAMSUNG; ProductCode: CL05B822KA5NNNC; VendorCode: 1276-1590-1-ND; Vendor: Digikey; Published: 8-Jun-2000; LatestRevisionDate: 17-Jul-2002; LatestRevisionNote: Re-released for DXP Platform.; PackageReference: RAD-0.3; Publisher: Altium Limited; Price: 0,09
D1 = LED3: SMD LED; Manufacturer: BROADCOM; ProductCode: HSMG-C190; Vendor: Digikey; VendorCode: 516-1425-1-ND; Published: 8-Jun-2000; LatestRevisionDate: 17-Dec-2003; LatestRevisionNote: PCB Footprint replaced.; DatasheetVersion: 16-Apr-2002; PackageVersion: 16-Apr-2002; PackageReference: 3.5X2.8X1.9; Publisher: Altium Limited; Price: 0,55
D2 D3 = LED3: SMD LED; Manufacturer: BROADCOM; ProductCode: HSMD-C191; Vendor: Digikey; VendorCode: 516-2826-1-ND; Published: 8-Jun-2000; LatestRevisionDate: 17-Dec-2003; LatestRevisionNote: PCB Footprint replaced.; DatasheetVersion: 16-Apr-2002; PackageVersion: 16-Apr-2002; PackageReference: 3.5X2.8X1.9; Publisher: Altium Limited; Price: 0,55
D4 = Diode Zener: Manufacturer: NEXPERIA; ProductCode: NZH9V1B; Vendor: Digikey; VendorCode: 1727-5081-1-ND; Price: 0,20
FB1 = Ferrite Bead: as FB2 on sheet 3.phy1; Published: 8-Jun-2000; LatestRevisionDate: 29-May-2009; LatestRevisionNote: IPC-7351 Footprint Added.; PackageReference: 0402-A; Publisher: Altium Limited; PackageDescription: Chip Inductor; Code_JEITA: 0402; Price: 0,11
J1 = XTAG2_CON: XTAG2 Connector; Manufacturer: HARWIN; Vendor: Digikey; VendorCode: 952-1672-1-ND; ProductCode: M40-3201045R; Price: 2,47
J2 = Molex Micro-USB 105017-1001: Micro-USB B Receptacle with Flange, Bottom Mount, SMT, Lead-Free; MP: 47346-0001; MF: Molex; Vendor: Digikey; VendorCode: WM11262CT-ND; Price: 1,43; Availability: Good; Package: None; Value: *; Manufacturer: MOLEX; ProductCode: 105017-1001
L1 L2 = Inductor: Manufacturer: WURTH; Code_IEC: 1005; ProductCode: 74479275222; Vendor: Digikey; VendorCode: 732-9708-1-ND; Published: 8-Jun-2000; LatestRevisionDate: 29-May-2009; LatestRevisionNote: IPC-7351 Footprint Added.; PackageReference: 0402-A; Publisher: Altium Limited; PackageDescription: Chip Inductor; Code_JEITA: 0402; Price: 1,28
P1 = Header 2: Header, 2-Pin; LatestRevisionDate: 17-Jul-2002; LatestRevisionNote: Re-released for DXP Platform.; Publisher: Altium Limited
P2 = Header 3: Header, 3-Pin; LatestRevisionDate: 17-Jul-2002; LatestRevisionNote: Re-released for DXP Platform.; Publisher: Altium Limited
R1 R3-R5 = Res: Resistor; Manufacturer: PANASONIC; ProductCode: ERJ-2GEJ102X; Vendor: Digikey; VendorCode: P1.0KJCT-ND; Published: 8-Jun-2000; LatestRevisionDate: 17-Jul-2002; LatestRevisionNote: Re-released for DXP Platform.; PackageReference: AXIAL-0.3; Publisher: Altium Limited; Price: 0,09
R2 = Res: Resistor; Manufacturer: PANASONIC; ProductCode: ERJ-2GEJ4R7X; Vendor: Digikey; VendorCode: P4.7JCT-ND; Published: 8-Jun-2000; LatestRevisionDate: 17-Jul-2002; LatestRevisionNote: Re-released for DXP Platform.; PackageReference: AXIAL-0.3; Publisher: Altium Limited; Price: 0,09
R6 R14 R15 R20 = Res: Resistor; Manufacturer: PANASONIC; VendorCode: P15984CT-ND; ProductCode: ERJ-2RHD1002X; Vendor: Digikey; Vendor: Digikeu; Published: 8-Jun-2000; LatestRevisionDate: 17-Jul-2002; LatestRevisionNote: Re-released for DXP Platform.; PackageReference: AXIAL-0.3; Publisher: Altium Limited; Price: 0,10
R7-R12 = Res: as R23 on sheet 3.phy1; Published: 8-Jun-2000; LatestRevisionDate: 17-Jul-2002; LatestRevisionNote: Re-released for DXP Platform.; PackageReference: AXIAL-0.3; Publisher: Altium Limited; Price: 0,02
R13 = Res: Resistor; Manufacturer: PANASONIC; VendorCode: P15984CT-ND; ProductCode: ERJ-2RHD1002X; Vendor: Digikey; Published: 8-Jun-2000; LatestRevisionDate: 17-Jul-2002; LatestRevisionNote: Re-released for DXP Platform.; PackageReference: AXIAL-0.3; Publisher: Altium Limited; Price: 0,10
R16 = Res: Resistor; Manufacturer: PANASONIC; Vendor: Digikey; ProductCode: ERJ-2RKF1004X; VendorCode: P1.00MLCT-ND; Published: 8-Jun-2000; LatestRevisionDate: 17-Jul-2002; LatestRevisionNote: Re-released for DXP Platform.; PackageReference: AXIAL-0.3; Publisher: Altium Limited; Price: 0,09
R17 = Res: Resistor; Manufacturer: PANASONIC; ProductCode: ERJ-2RKF1003X; VendorCode: P100KLCT-ND; Vendor: Digikey; Published: 8-Jun-2000; LatestRevisionDate: 17-Jul-2002; LatestRevisionNote: Re-released for DXP Platform.; PackageReference: AXIAL-0.3; Publisher: Altium Limited; Price: 0,09
R18 = Res: Resistor; Manufacturer: PANASONIC; ProductCode: ERA-2AEB3322X; Vendor: Digikey; VendorCode: P33.2KDCCT-ND; Published: 8-Jun-2000; LatestRevisionDate: 17-Jul-2002; LatestRevisionNote: Re-released for DXP Platform.; PackageReference: AXIAL-0.3; Publisher: Altium Limited; Price: 0,40
R19 = Res: Resistor; Manufacturer: PANASONIC; ProductCode: ERA-2AEB3091X; Vendor: Digikey; VendorCode: P3.09KDCCT-ND; Published: 8-Jun-2000; LatestRevisionDate: 17-Jul-2002; LatestRevisionNote: Re-released for DXP Platform.; PackageReference: AXIAL-0.3; Publisher: Altium Limited; Price: 0,40
R21 R22 = Res: Resistor; Manufacturer: PANASONIC; ProductCode: ERJ-2RHD1002X; Vendor: Digikey; VendorCode: P15984CT-ND; Published: 8-Jun-2000; LatestRevisionDate: 17-Jul-2002; LatestRevisionNote: Re-released for DXP Platform.; PackageReference: AXIAL-0.3; Publisher: Altium Limited; Price: 0,10
S1 = SW-PB: Switch; Manufacturer: PANASONIC; ProductCode: EVQ-5PN05K; VendorCode: P13596SCT-ND; Vendor: Digikey; Published: 24-Mar-1999; LatestRevisionDate: 17-Jul-2002; LatestRevisionNote: Re-released for DXP Platform.; PackageReference: SPST-2; Publisher: Altium Limited; Price: 0,54
U1 = XEF216-512-TQ128: XMOS xCORE200 Processor; Manufacturer Part Number: XE216-512-TQ128; XMOS Part Number: JG-NEW-0002; ProductCode: XEF216-512-TQ128-C20; Vendor: Digikey; VendorCode: 880-1100-ND; Manufacturer: XMOS; Price: 18,00
U2 = NC7NZ34: Tripple Buffer; Manufacturer: ON SEMICONDUCTOR; ProductCode: NC7NZ34K8X; Vendor: Digikey; VendorCode: NC7NZ34K8XCT-ND; Price: 0,45
U3 = NC7WZ07: Dual Buffer (open drain output); Manufacturer: ON SEMICONDUCTOR; Vendor: Digikey; ProductCode: NC7WZ07P6X; VendorCode: NC7WZ07P6XCT-ND; PricePerPiece: 0,36; Price: 0,36
U4 U5 = TPS562210: Buck converter; Manufacturer: TEXAS INSTRUMENTS; ProductCode: TPS562210DDFT; VendorCode: 296-41139-1-ND; Vendor: Digikey; Price: 1,48
U6 = TPS3808G09: Power on Reset controller 0.9V; Manufacturer: TEXAS INSTRUMENTS; ProductCode: TPS3808G09DBVR; VendorCode: 296-17189-1-ND; Vendor: Digikey; Price: 1,74
Y1 = oscillator: Crystal Oscillator; Manufacturer: ABRACON; ProductCode: ASTMLPE-25.000MHZ-EJ-E-T; VendorCode: 535-13121-1-ND; Vendor: Digikey; Price: 1,50

## Nets that join several sheets
3V3: 3.phy1 (11 pins), 4.phy2 (11 pins), 2.processor (39 pins)
GND: 3.phy1 (21 pins), 4.phy2 (21 pins), 2.processor (54 pins)
ETH1_MDC: 3.phy1 (U7.31), 2.processor (U1.89)
ETH1_MDIO: 3.phy1 (R30.1 U7.30), 2.processor (U1.90)
ETH1_PHYCLK: 3.phy1 (U7.34), 2.processor (R12.1)
ETH1_RST: 3.phy1 (U7.29), 2.processor (U1.91)
ETH1_RXCLK: 3.phy1 (R35.1), 2.processor (U1.88)
ETH1_RXD0: 3.phy1 (U7.43), 2.processor (U1.68)
ETH1_RXD1: 3.phy1 (U7.44), 2.processor (U1.69)
ETH1_RXD2: 3.phy1 (U7.45), 2.processor (U1.70)
ETH1_RXD3: 3.phy1 (U7.46), 2.processor (U1.71)
ETH1_RXDV: 3.phy1 (U7.39), 2.processor (U1.66)
ETH1_RXER: 3.phy1 (U7.41), 2.processor (U1.64)
ETH1_TXCLK: 3.phy1 (R23.1), 2.processor (U1.63)
ETH1_TXD0: 3.phy1 (U7.3), 2.processor (U1.57)
ETH1_TXD1: 3.phy1 (U7.4), 2.processor (U1.58)
ETH1_TXD2: 3.phy1 (U7.5), 2.processor (U1.59)
ETH1_TXD3: 3.phy1 (U7.6), 2.processor (U1.61)
ETH1_TXEN: 3.phy1 (U7.2), 2.processor (U1.62)
ETH2_MDC: 4.phy2 (U8.31), 2.processor (U1.18)
ETH2_MDIO: 4.phy2 (R45.1 U8.30), 2.processor (U1.20)
ETH2_PHYCLK: 4.phy2 (U8.34), 2.processor (R11.1)
ETH2_RST: 4.phy2 (U8.29), 2.processor (U1.21)
ETH2_RXCLK: 4.phy2 (R50.1), 2.processor (U1.15)
ETH2_RXD0: 4.phy2 (U8.43), 2.processor (U1.114)
ETH2_RXD1: 4.phy2 (U8.44), 2.processor (U1.115)
ETH2_RXD2: 4.phy2 (U8.45), 2.processor (U1.116)
ETH2_RXD3: 4.phy2 (U8.46), 2.processor (U1.117)
ETH2_RXDV: 4.phy2 (U8.39), 2.processor (U1.13)
ETH2_RXER: 4.phy2 (U8.41), 2.processor (U1.122)
ETH2_TXCLK: 4.phy2 (R38.1), 2.processor (U1.121)
ETH2_TXD0: 4.phy2 (U8.3), 2.processor (U1.112)
ETH2_TXD1: 4.phy2 (U8.4), 2.processor (U1.113)
ETH2_TXD2: 4.phy2 (U8.5), 2.processor (U1.118)
ETH2_TXD3: 4.phy2 (U8.6), 2.processor (U1.119)
ETH2_TXEN: 4.phy2 (U8.2), 2.processor (U1.86)